# Altium schematic sheet MAGNETOMETER.SchDoc
size A; SheetNumber: 3; SheetTotal: 4
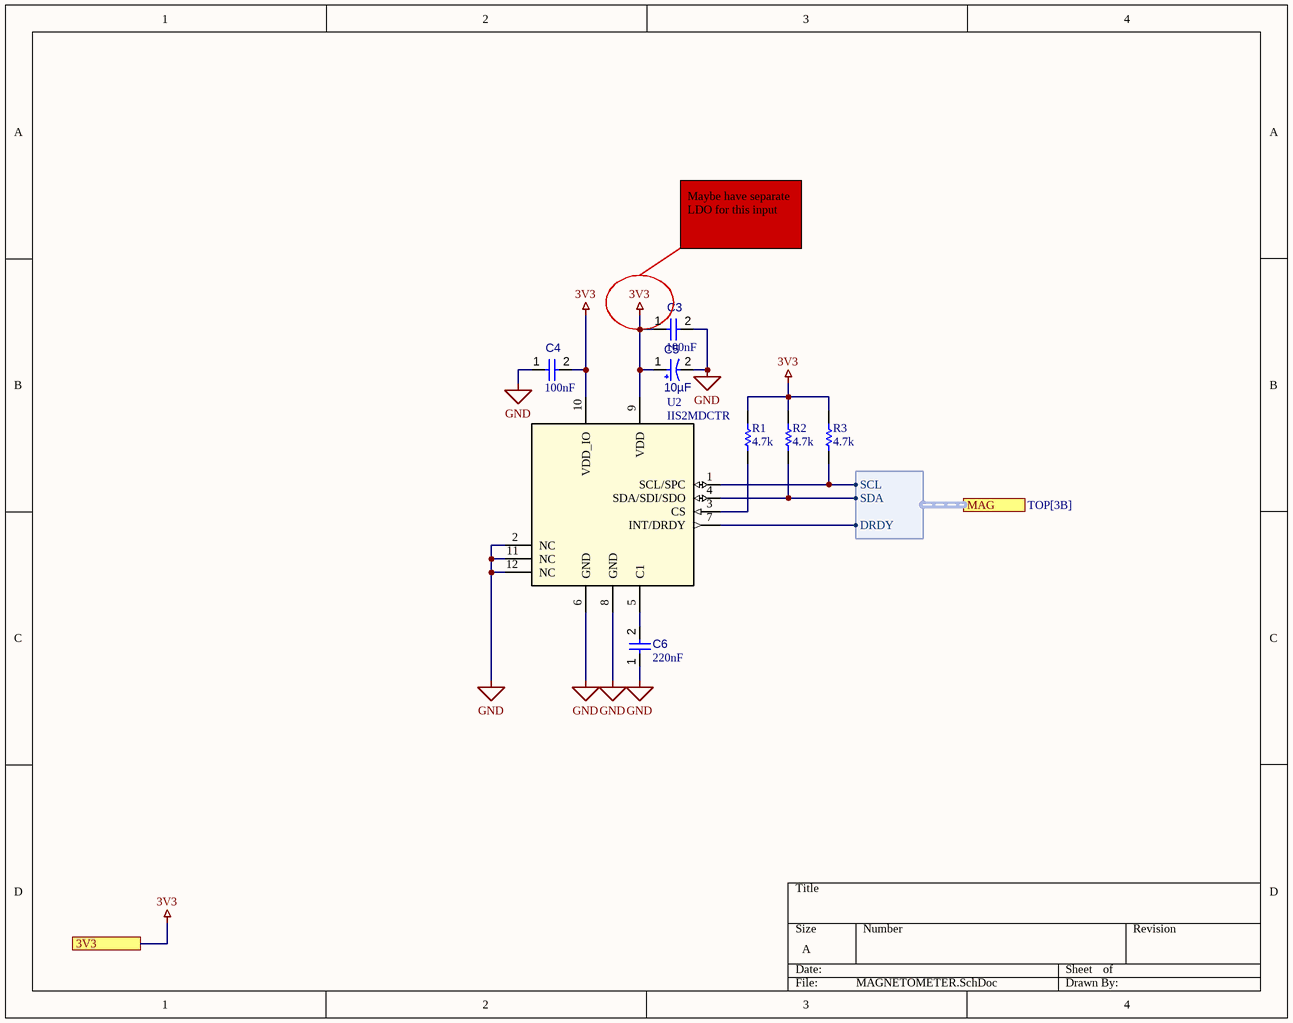
[diagram p0: MAGNETOMETER.SchDoc]

## Parts
C3  value 100nF  [CAPC1005X56X25LL10T15]  (hidden comment: Capacitor 0.1 uF +/- 5% 16 V 0402)
C4  value 100nF  [CAPC1005X56X25LL10T15]  (hidden comment: Capacitor 0.1 uF +/- 5% 16 V 0402)
C5  10µF
C6  value 220nF  [CAPC0402(1005)60_L]  (hidden comment: Capacitor 220nF +/-20% 10V 0402)
R1  value 4.7k  [RESC1005X40X25ML05T05]  (hidden comment: Resistor 4k7 +/-1% 0402 100 mW)
R2  value 4.7k  [RESC1005X40X25ML05T05]  (hidden comment: Resistor 4k7 +/-1% 0402 100 mW)
R3  value 4.7k  [RESC1005X40X25ML05T05]  (hidden comment: Resistor 4k7 +/-1% 0402 100 mW)
U2  IIS2MDCTR  [LGA-12_2X2X0P7_STM]

## Ports
3V3, MAG (harness MAGNETOMETER, see TOP[3B])

## Harnesses
MAGNETOMETER: SCL, SDA, DRDY

## Nets
3V3: C3.1 C4.2 C5.1 R1.2 R2.2 R3.2 U2.9(VDD) U2.10(VDD_IO) ; port 3V3
GND: C3.2 C4.1 C5.2 C6.1 U2.2(NC) U2.6(GND) U2.8(GND) U2.11(NC) U2.12(NC)
NetC6_2: C6.2 U2.5(C1)
NetR1_1: R1.1 U2.3(CS)
NetR2_1: R2.1 U2.4(SDA/SDI/SDO) ; port MAG.SDA
NetR3_1: R3.1 U2.1(SCL/SPC) ; port MAG.SCL
NetU2_7: U2.7(INT/DRDY) ; port MAG.DRDY

## Notes on the sheet
- Maybe have separate LDO for this input

## Library data of the parts
C3 C4 = CMP-001-00001-6: Chip Capacitor, 0.1 uF, +/- 5%, 16 V, 0402 (1005 Metric); Capacitor Type: Ceramic; Voltage Rating: 16V; Max Operating Temperature: 125°C; Min Operating Temperature: -55°C; Case/Package: 0402; Mounting Technology: SM; Pins: 2; Tolerance: 5%; RoHS Compliant: True
C5 = CMP-001-00084-3: Aluminum Electrolytic Capacitor, Polarized, Aluminum (wet), 50V, 20% +Tol, 20% -Tol, 10uF, Surface Mount, 2525; Capacitor Type: Aluminium; Ripple Current: 26mA; Max Operating Temperature: 105°C; Min Operating Temperature: -55°C; RoHS Compliant: Yes
C6 = CMP-001-00057-3: Chip Capacitor, 220nF +/-20%, 10V, 0402, Thickness 0.6 mm; Tolerance: 10%; Case/Package: 0402; Mounting Technology: SMT; Pins: 2; Max Operating Temperature: 85°C; Min Operating Temperature: -55°C; Voltage Rating: 10V
R1-R3 = CMP-009-00030-2: Chip Resistor, 4.7 KOhm, +/- 1%, 0.1 W, -55 to 155 degC, 0402 (1005 Metric); Voltage Rating: 50V; Power: 100mW; Mounting Technology: SM; Case/Package: 0402; Pins: 2; Min Operating Temperature: -55°C; RoHS Compliant: True; Tolerance: 1%; Resistance: 4.7k; Max Operating Temperature: 155°C
U2 = IIS2MDCTR: No Description Available; Mfr_Name: STMicroelectronics; Copyright: Copyright (C) 2022 Ultra Librarian. All rights reserved.; Manufacturer_Part_Number: IIS2MDCTR; RefDes: RefDes; Type: DEV